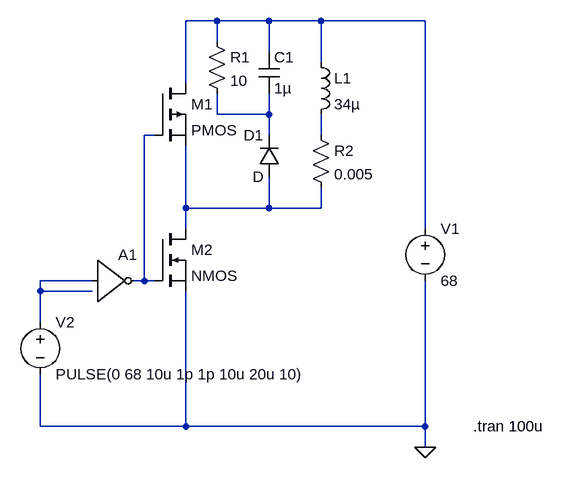
[diagram p0: schematic Mosfet_RCD_protection.asc]
Mosfet_RCD_protection.asc, the LTspice schematic file:
Version 4
SHEET 1 880 680
WIRE 64 -112 16 -112
WIRE 144 -112 64 -112
WIRE 224 -112 144 -112
WIRE 384 -112 224 -112
WIRE 64 -80 64 -112
WIRE 144 -64 144 -112
WIRE 224 -48 224 -112
WIRE 16 -16 16 -112
WIRE 64 32 64 0
WIRE 144 32 144 0
WIRE 144 32 64 32
WIRE -32 64 -48 64
WIRE 144 64 144 32
WIRE 224 64 224 32
WIRE 16 176 16 80
WIRE 144 176 144 128
WIRE 144 176 16 176
WIRE 224 176 224 144
WIRE 224 176 144 176
WIRE 16 208 16 176
WIRE 384 208 384 -112
WIRE -128 288 -208 288
WIRE -48 288 -48 64
WIRE -48 288 -64 288
WIRE -32 288 -48 288
WIRE -208 304 -208 288
WIRE -128 304 -208 304
WIRE -208 352 -208 304
WIRE -208 512 -208 432
WIRE 16 512 16 304
WIRE 16 512 -208 512
WIRE 384 512 384 288
WIRE 384 512 16 512
WIRE 384 544 384 512
FLAG 384 544 0
SYMBOL ind 208 -64 R0
SYMATTR InstName L1
SYMATTR Value 34µ
SYMATTR SpiceLine Rser=0.01
SYMBOL cap 128 -64 R0
SYMATTR InstName C1
SYMATTR Value 1µ
SYMBOL res 48 -96 R0
SYMATTR InstName R1
SYMATTR Value 10
SYMBOL voltage 384 192 R0
WINDOW 123 0 0 Left 0
WINDOW 39 0 0 Left 0
SYMATTR InstName V1
SYMATTR Value 68
SYMBOL diode 160 128 R180
WINDOW 0 24 64 Left 2
WINDOW 3 24 0 Left 2
SYMATTR InstName D1
SYMBOL res 208 48 R0
SYMATTR InstName R2
SYMATTR Value 0.005
SYMBOL Digital\\inv -128 224 R0
SYMATTR InstName A1
SYMBOL voltage -208 336 R0
WINDOW 123 0 0 Left 0
WINDOW 39 0 0 Left 0
SYMATTR InstName V2
SYMATTR Value PULSE(0 68 10u 1p 1p 10u 20u 10)
SYMBOL pmos -32 -16 R0
SYMATTR InstName M1
SYMBOL nmos -32 208 R0
SYMATTR InstName M2
TEXT 458 512 Left 2 !.tran 100u

The netlist it stands for:
* Mosfet_RCD_protection.asc
L1 N001 N004 34µ Rser=0.01
C1 N001 N002 1µ
R1 N001 N002 10
V1 N001 0 68
D1 N005 N002 D
R2 N004 N005 0.005
A1 N006 N006 N006 N006 N006 N003 N006 N006 BUF
V2 N006 0 PULSE(0 68 10u 1p 1p 10u 20u 10)
M1 N001 N003 N005 N005 PMOS
M2 N005 N003 0 0 NMOS
.model D D
.lib standard.dio
.model NMOS NMOS
.model PMOS PMOS
.lib standard.mos
.tran 100u
.backanno
.end